# EAGLE design wisleep_dbg_revB (EAGLE 6.5.0)
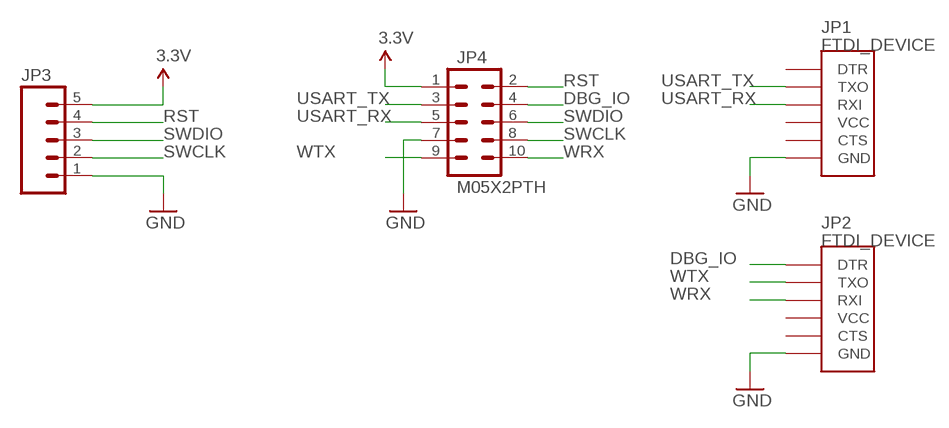
[diagram p0: schematic, sheet 1]

## Parts
JP1  FTDI_DEVICE  [FTDI_DEVICE_SIDE]
JP2  FTDI_DEVICE  [FTDI_DEVICE_SIDE]
JP3  M05LOCK  [1X05_LOCK]
JP4  M05X2PTH  [AVR_ICSP]

## Nets
3.3V: JP3.5 JP4.1
DBG_IO: JP2.P$1(DTR) JP4.4
GND: JP1.P$6(GND) JP2.P$6(GND) JP3.1 JP4.7
RST: JP3.4 JP4.2
SWCLK: JP3.2 JP4.8
SWDIO: JP3.3 JP4.6
USART_RX: JP1.P$3(RXI) JP4.5
USART_TX: JP1.P$2(TXO) JP4.3
WRX: JP2.P$3(RXI) JP4.10
WTX: JP2.P$2(TXO) JP4.9
Unconnected: JP1.P$1(DTR) JP1.P$4(VCC) JP1.P$5(CTS) JP2.P$4(VCC) JP2.P$5(CTS)

## Library data of the parts
JP1 JP2 = SparkFun-Connectors:FTDI_DEVICE: Connector which mates to FTDI basic or FTDI cable.
JP3 = SparkFun-Connectors:M05: Header 5 Standard 5-pin 0.1" header. Use with straight break away headers (SKU : PRT-00116), right angle break away headers (PRT-00553), swiss pins (PRT-00743), machine pins (PRT-00117), and female headers (PRT-00115). Molex polarized connector foot print use with SKU : PRT-08230 with associated crimp pins and housings.
JP4 = SparkFun-Connectors:M05X2: Header 5x2 Standard 10-pin dual row 0.1" header. Commonly used with AVR-ISP. Use with Spark Fun Electronics SKU: PRT-00778

## Board
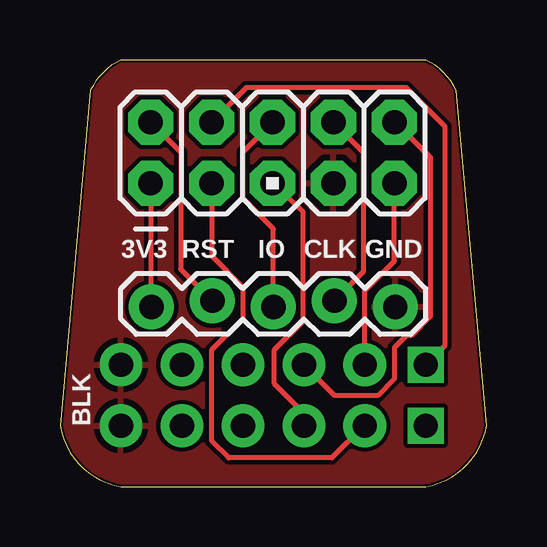
[diagram p1: board, top side]
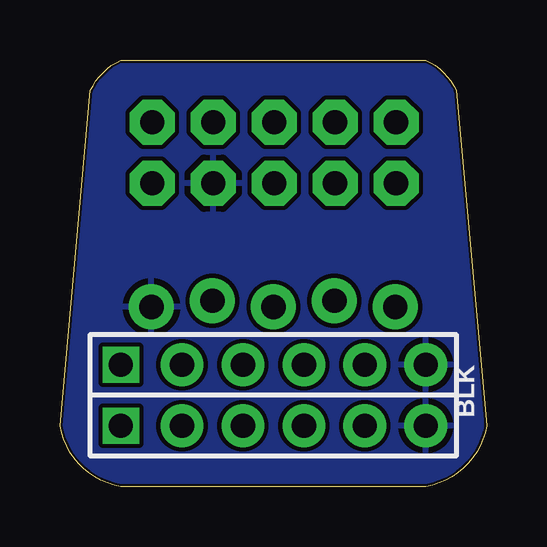
[diagram p2: board, bottom side, seen from below]

Size 17.78 x 17.78 mm. Coordinates in mm from the lower left corner, seen from the top.
Outline: 0,2.54 arc70 2.54,0 15.24,0 arc70 17.78,2.54 16.51,16.51 arc40 15.24,17.78 2.54,17.78 arc40 1.27,16.51 0,2.54
Copper layers (1*16): Top 0.035mm / dielectric 1.5mm / Bottom 0.035mm
Design rules "batchpcb_onthelimits *": minimum track width 7mil, minimum drill 15mil, track to track 7mil, track to pad 7mil, pad to pad 7mil, via to via 7mil, smd to smd 7mil, copper to edge 4mil, drill to drill 7mil, minimum pad ring 10mil, minimum via ring 8mil, stop-mask expansion 4mil, vias tented up to drill 0mil, thermal gap 10mil

### Footprints (pad centres in the part's own frame; a part is rotated, then mirrored left to right if it is on the bottom)
FTDI_DEVICE_SIDE = drill 1 square: P$1 -6.35,0 | drill 1.016 pad 1.778: P$2 -3.81,0; P$3 -1.27,0; P$4 1.27,0; P$5 3.81,0; P$6 6.35,0
1X05_LOCK = drill 1.016 pad 1.88: 1 0,0.127; 2 2.54,-0.127; 3 5.08,0.127; 4 7.62,-0.127; 5 10.16,0.127
AVR_ICSP = drill 1.016 pad 1.88 octagon: 1 -1.27,5.08; 2 1.27,5.08; 3 -1.27,2.54; 4 1.27,2.54; 5 -1.27,0; 6 1.27,0; 7 -1.27,-2.54; 8 1.27,-2.54; 9 -1.27,-5.08; 10 1.27,-5.08

### Placement (x,y rotation side)
JP1  8.89,2.54 0 bottom
JP2  8.89,5.08 0 bottom
JP3  13.97,7.62 180 top
JP4  8.86,13.91 90 top

### Tracks (layer width: path | path; a pad name or v marks a point on that pad's centre or on a via)
3.3V
  Top 0.203: JP4.1 3.77,7.53 JP3.5
DBG_IO
  Top 0.203: JP4.4 7.76,16.63 14.43,16.63 16.03,15.03 16.03,5.87 JP2.P$1
GND
  pour Top (isolate 0.025): -1.27,0 -1.27,18.41 19.68,18.41 19.68,0
  pour Bottom (isolate 0.025): -1.27,0 -1.27,18.41 19.68,18.41 19.68,0
RST
  Top 0.203: JP4.2 5.03,13.93 5.03,9.07 JP3.4
SWCLK
  Top 0.203: JP4.8 11.39,15.16 12.63,13.93 12.63,8.95 JP3.2
SWDIO
  Top 0.203: 8.88,15.19 JP4.6 7.63,13.96 7.63,12 8.89,10.74 JP3.3
USART_RX
  Top 0.203: JP1.P$3 10.16,3.07 8.93,4.3 8.93,5.7 10.13,6.9 10.13,11.44 JP4.5
USART_TX
  Top 0.203: JP1.P$2 12.67,2.54 11.33,1.2 7.03,1.2 6.33,1.9 6.33,5.7 7.63,7 7.63,8.3 6.31,9.62 JP4.3
WRX
  Top 0.203: JP4.10 13.97,15.19 15.43,13.73 15.43,7.1 14.63,6.3 14.43,6.3 13.93,5.8 13.93,4.5 13.23,3.8 11.44,3.8 JP2.P$3
WTX
  Top 0.203: JP2.P$2 12.7,8.17 13.93,9.4 JP4.9

### Text on the board
_tsilk: 3V3 | RST | IO | CLK | GND | BLK
_bsilk: BLK